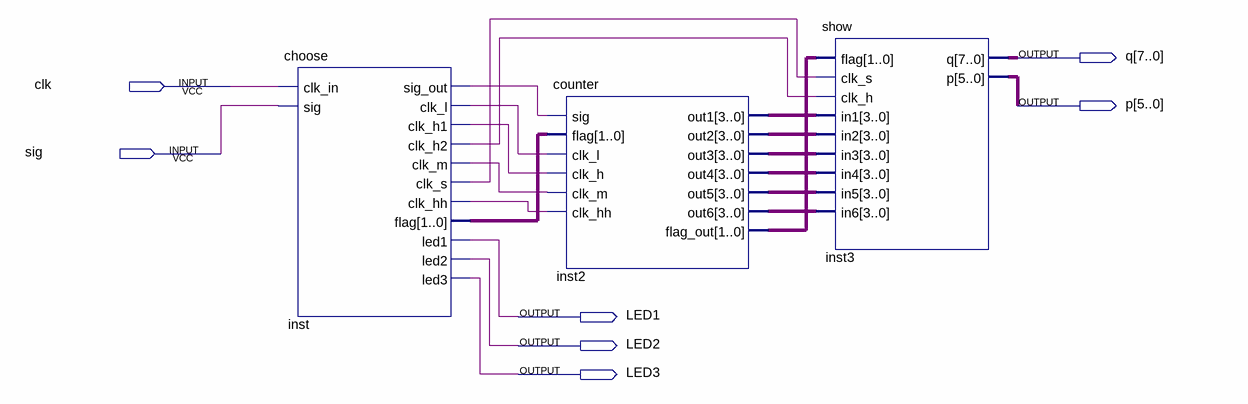
[diagram p0: schematic sheet]
// Quartus schematic f_m.bdf as structural Verilog: 3 symbols, 7 pins
module f_m (
  input  clk,
  input  sig,
  output [7:0] q,
  output [5:0] p,
  output LED1,
  output LED2,
  output LED3
);

  wire inst_clk_h1, inst_clk_h2, inst_clk_hh, inst_clk_l, inst_clk_m, inst_clk_s, inst_sig_out;
  wire [1:0] inst2_flag_out, inst_flag;
  wire [3:0] inst2_out1, inst2_out2, inst2_out3, inst2_out4, inst2_out5, inst2_out6;

  choose inst (
    .clk_in(clk), .sig(sig), .sig_out(inst_sig_out), .clk_l(inst_clk_l), .clk_h1(inst_clk_h1),
    .clk_h2(inst_clk_h2), .clk_m(inst_clk_m), .clk_s(inst_clk_s), .clk_hh(inst_clk_hh), .flag(inst_flag),
    .led1(LED1), .led2(LED2), .led3(LED3));
  counter inst2 (
    .sig(inst_sig_out), .flag(inst_flag), .clk_l(inst_clk_l), .clk_h(inst_clk_h1), .clk_m(inst_clk_m),
    .clk_hh(inst_clk_hh), .out1(inst2_out1), .out2(inst2_out2), .out3(inst2_out3), .out4(inst2_out4),
    .out5(inst2_out5), .out6(inst2_out6), .flag_out(inst2_flag_out));
  show inst3 (
    .flag(inst2_flag_out), .clk_s(inst_clk_s), .clk_h(inst_clk_h2), .in1(inst2_out1), .in2(inst2_out2),
    .in3(inst2_out3), .in4(inst2_out4), .in5(inst2_out5), .in6(inst2_out6), .q(q), .p(p));
endmodule
